# EAGLE design demo2 (EAGLE 6.0)
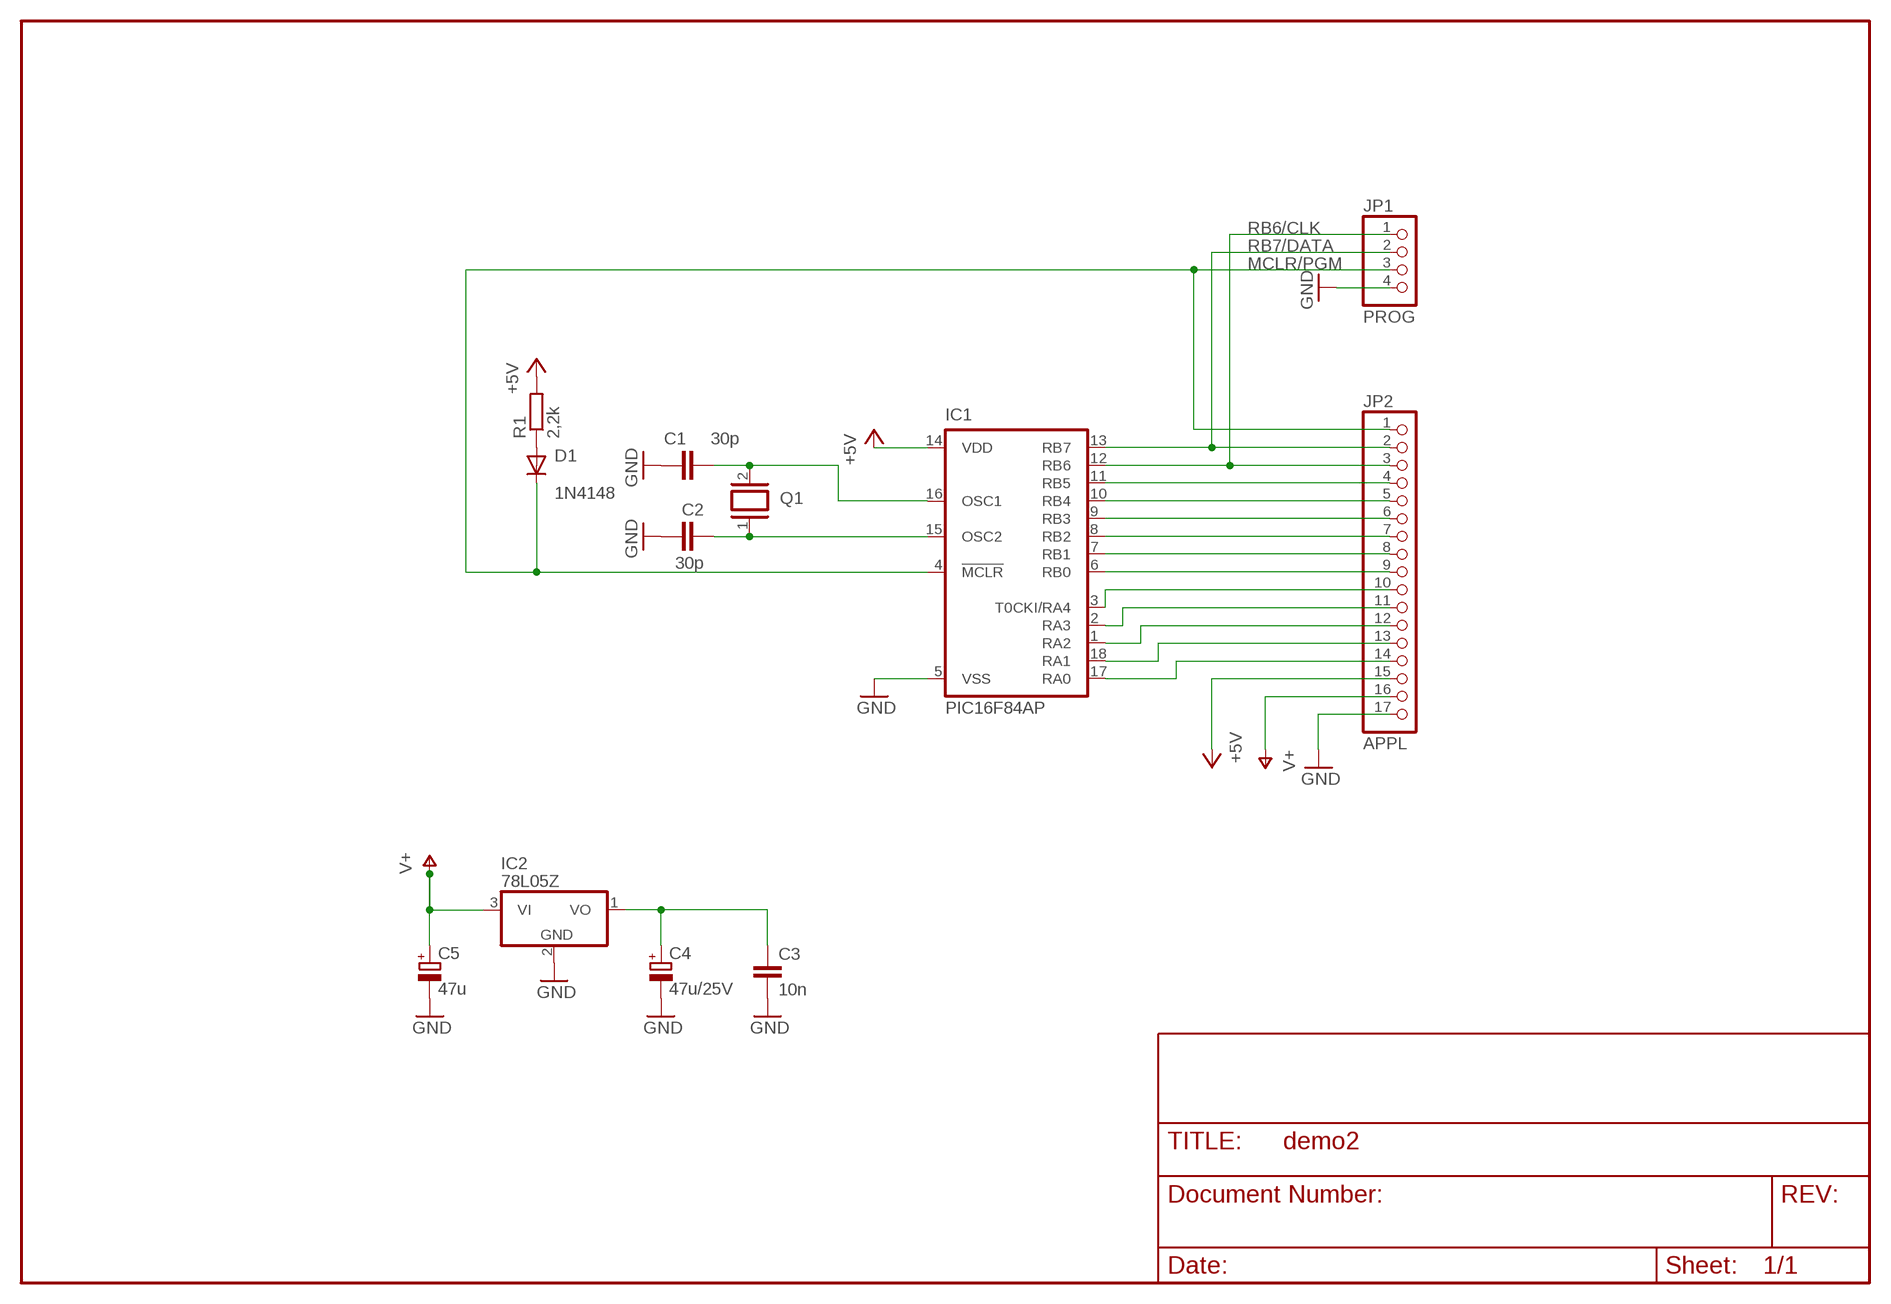
[diagram p0: schematic, sheet 1]

## Parts
C1  30p  C-EUC1206  [C1206]
C2  30p  C-EUC1206  [C1206]
C3  10n  C-EU025-025X050  [C025-025X050]
C4  47u/25V  CPOL-EUTAP5-45  [TAP5-45]
C5  47u  CPOL-EUTAP5-45  [TAP5-45]
D1  1N4148  [DO35-10]
IC1  PIC16F84AP  [DIL18]
IC2  78L05Z  [TO92]
JP1  PROG  PINHD-1X4  [1X04]
JP2  APPL  PINHD-1X17  [1X17]
Q1  XTAL/S  [QS]
R1  2,2k  R-EU_R1206  [R1206]

## Nets
+5V [power]: IC1.14(VDD) JP2.15 R1.1
GND [power]: C1.1 C2.1 C3.2 C4.- C5.- IC1.5(VSS) IC2.2(GND) JP1.4 JP2.17
MCLR/PGM: D1.C IC1.4(!MCLR) JP1.3 JP2.1
N$1: C3.1 C4.+ IC2.1(VO)
N$2: C1.2 IC1.16(OSC1) Q1.2
N$3: C2.2 IC1.15(OSC2) Q1.1
N$4: D1.A R1.2
RA0: IC1.17(RA0) JP2.14
RA1: IC1.18(RA1) JP2.13
RA2: IC1.1(RA2) JP2.12
RA3: IC1.2(RA3) JP2.11
RA4: IC1.3(T0CKI/RA4) JP2.10
RB0: IC1.6(RB0) JP2.9
RB1: IC1.7(RB1) JP2.8
RB2: IC1.8(RB2) JP2.7
RB3: IC1.9(RB3) JP2.6
RB4: IC1.10(RB4) JP2.5
RB5: IC1.11(RB5) JP2.4
RB6/CLK: IC1.12(RB6) JP1.1 JP2.3
RB7/DATA: IC1.13(RB7) JP1.2 JP2.2
V+ [power]: C5.+ IC2.3(VI) JP2.16

## Library data of the parts
C1-C3 = rcl:C-EU: CAPACITOR, European symbol
C4 C5 = rcl:CPOL-EU: POLARIZED CAPACITOR, European symbol
D1 = diode:1N4148: DIODE high speed (Philips)
IC1 = microchip:PIC16F8*: MICROCONTROLLER 8-Bit PIC16F8X Family - CMOS Flash/EEPROM Pin Compatible : PIC16F83, PIC16CR83, PIC16F84A, PIC16CR84 see also PIC16C*
IC2 = linear:78*: Positive VOLTAGE REGULATOR
JP1 = pinhead:PINHD-1X4: PIN HEADER
JP2 = pinhead:PINHD-1X17: PIN HEADER
Q1 = special:XTAL/S: CRYSTAL
R1 = rcl:R-EU_: RESISTOR, European symbol

## Net classes
0 default: width 0.3 mm, drill 0.6 mm, clearance 0.2 mm
1 power: width 0.4 mm, drill 0.6 mm, clearance 0.2 mm

## Board
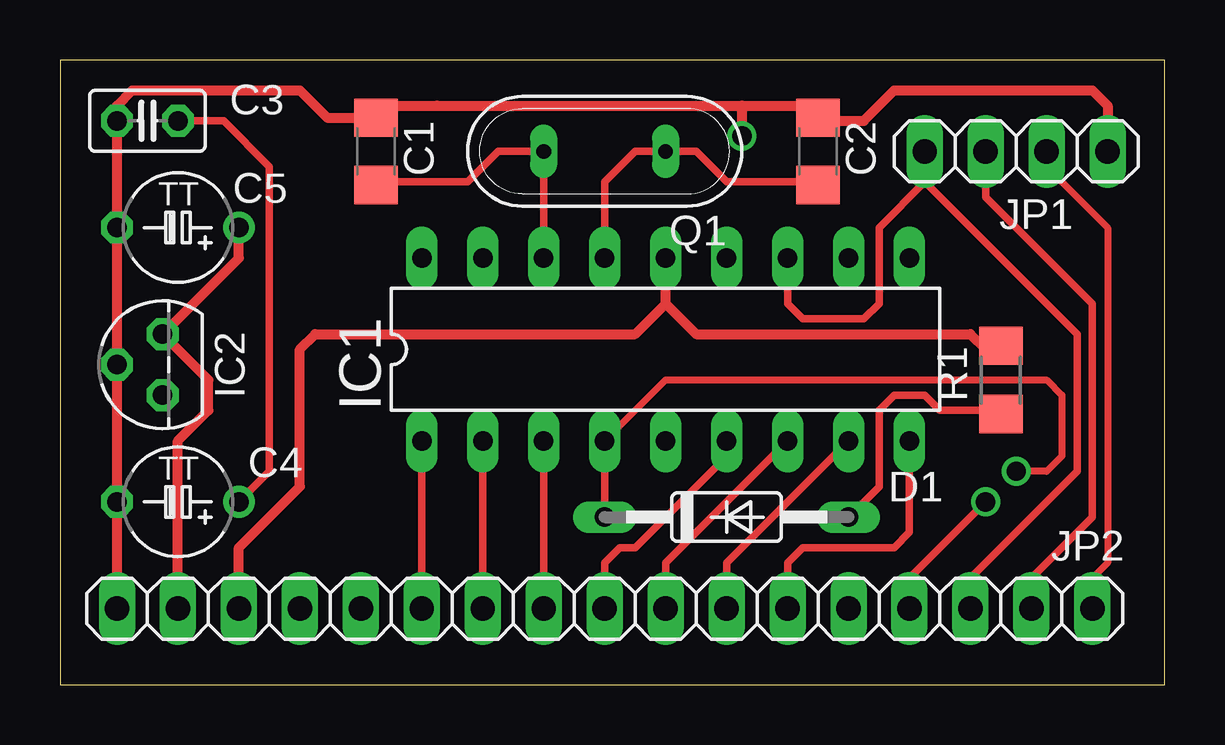
[diagram p1: board, top side]
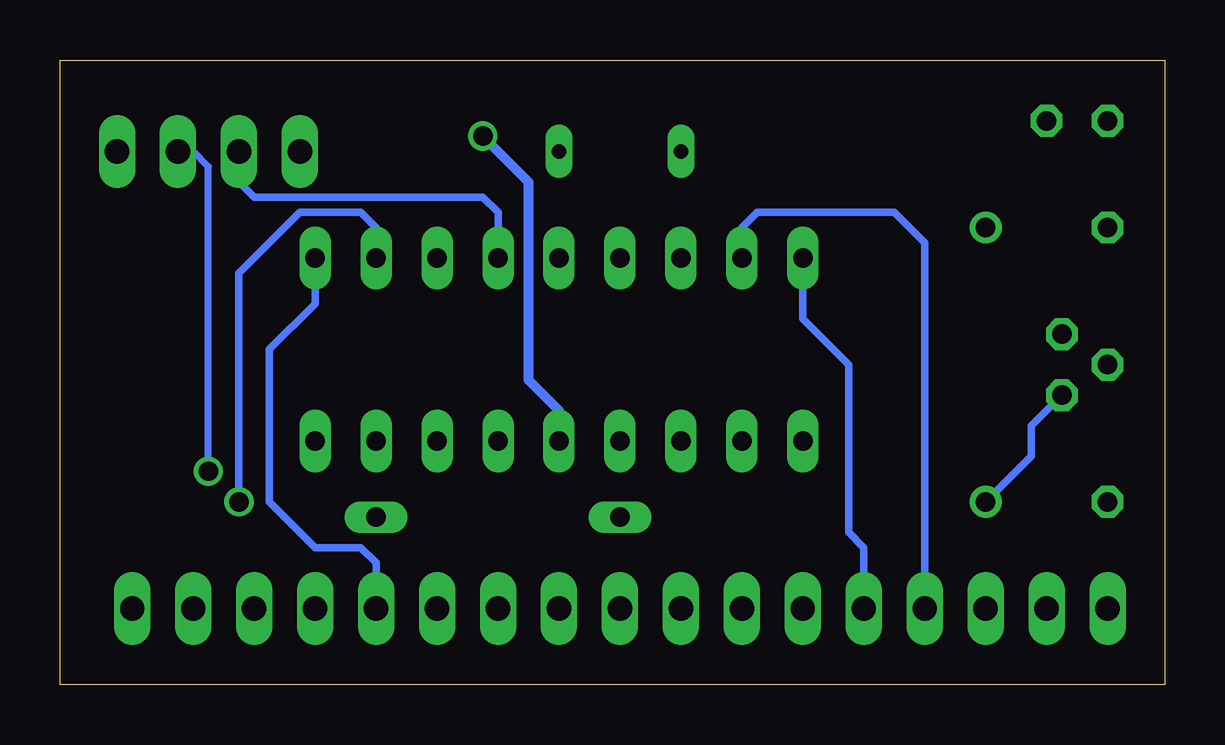
[diagram p2: board, bottom side, seen from below]

Size 46.02 x 26.02 mm. Coordinates in mm from the lower left corner, seen from the top.
Outline: 0,0 46.02,0 46.02,26.02 0,26.02 0,0
Copper layers (1*16): Top 0.035mm / dielectric 1.5mm / Bottom 0.035mm
Design rules: minimum track width 10mil, minimum drill 24mil, track to track 8mil, track to pad 8mil, pad to pad 8mil, via to via 8mil, smd to smd 8mil, copper to edge 40mil, drill to drill 8mil, minimum pad ring 10mil, minimum via ring 8mil, stop-mask expansion 4mil, vias tented up to drill 0mil, thermal gap 10mil

### Footprints (pad centres in the part's own frame; a part is rotated, then mirrored left to right if it is on the bottom)
C1206 = smd 1.6 x 1.8: 1 -1.4,0; 2 1.4,0
C025-025X050 = drill 0.813 octagon: 1 -1.27,0; 2 1.27,0
TAP5-45 = drill 0.813: + -2.54,0 | drill 0.813 octagon: - 2.54,0
DO35-10 = drill 0.813 long: A 5.08,0; C -5.08,0
DIL18 = drill 0.813 long: 1 -10.16,-3.81; 2 -7.62,-3.81; 3 -5.08,-3.81; 4 -2.54,-3.81; 5 0,-3.81; 6 2.54,-3.81; 7 5.08,-3.81; 8 7.62,-3.81; 9 10.16,-3.81; 10 10.16,3.81; 11 7.62,3.81; 12 5.08,3.81; 13 2.54,3.81; 14 0,3.81; 15 -2.54,3.81; 16 -5.08,3.81; 17 -7.62,3.81; 18 -10.16,3.81
TO92 = drill 0.813 octagon: 1 -1.27,0; 2 0,1.905; 3 1.27,0
1X04 = drill 1.016 long: 1 -3.81,0; 2 -1.27,0; 3 1.27,0; 4 3.81,0
1X17 = drill 1.016 long: 1 -20.32,0; 2 -17.78,0; 3 -15.24,0; 4 -12.7,0; 5 -10.16,0; 6 -7.62,0; 7 -5.08,0; 8 -2.54,0; 9 0,0; 10 2.54,0; 11 5.08,0; 12 7.62,0; 13 10.16,0; 14 12.7,0; 15 15.24,0; 16 17.78,0; 17 20.32,0
QS = drill 0.61 long: 1 -2.54,0; 2 2.54,0
R1206 = smd 1.6 x 1.803: 1 -1.422,0; 2 1.422,0

### Placement (x,y rotation side)
C1  13.17,22.22 270 top
C2  31.58,22.22 270 top
C3  3.64,23.49 180 top
C4  4.92,7.62 180 top
C5  4.92,19.04 180 top
D1  27.77,6.98 0 top
IC1  25.23,13.97 0 top
IC2  4.28,13.33 90 top
JP1  39.84,22.22 0 top
JP2  22.7,3.17 180 top
Q1  22.7,22.22 180 top
R1  39.2,12.7 270 top

### Tracks (layer width: path | path; a pad name or v marks a point on that pad's centre or on a via)
+5V
  Top 0.406: 25.23,15.87 23.96,14.6 10.63,14.6 10,13.97 10,8.25 7.46,5.71 JP2.15 | 25.23,15.87 IC1.14 | 25.23,15.87 26.5,14.6 37.94,14.6 38.57,13.97 39.2,13.97 R1.1
GND  (via drill 0.81)
  Top 0.406: JP2.17 C4.- IC2.2 C5.- C3.2 2.38,24.12 3.01,24.76 10,24.76 11.13,23.62 13.04,23.62 13.17,23.49 | 28.41,24.12 15.71,24.12 13.81,24.12 13.17,23.49 | 28.41,24.12 30.95,24.12 | JP1.4 43.65,24.12 43.02,24.76 34.76,24.76 33.49,23.49 31.58,23.49 | 31.58,23.49 C2.1 31.58,23.49 | 28.41,24.12 30.95,24.12 | 28.41,24.12 v28.41,22.86 | 30.95,24.12 31.58,23.49 | 13.17,23.49 C1.1 13.17,23.49
  Bottom 0.406: v28.41,22.86 26.5,20.95 26.5,12.7 25.23,11.43 IC1.5
MCLR/PGM  (via drill 0.8)
  Top 0.3: JP2.1 43.02,4.44 43.65,5.08 43.65,19.04 41.11,21.58 JP1.3 | v39.84,8.89 41.11,8.89 41.74,9.52 41.74,12.06 41.11,12.7 25.23,12.7 IC1.4
  Top 0.305: D1.C IC1.4
  Bottom 0.3: v39.84,8.89 39.84,21.58 40.48,22.22 JP1.3
N$1
  Top 0.305: C3.1 6.82,23.49 8.73,21.58 8.73,8.89 C4.+
  Bottom 0.305: C4.+ 5.55,9.52 5.55,10.79 IC2.1
N$2
  Top 0.305: C1.2 13.3,20.95 16.98,20.95 18.25,22.22 Q1.2 IC1.16
N$3
  Top 0.305: IC1.15 22.7,20.95 23.96,22.22 Q1.1 26.5,22.22 27.77,20.95 31.58,20.95 C2.2
N$4
  Top 0.305: D1.A 34.12,8.25 34.12,11.43 34.76,12.06 36.03,12.06 36.66,11.43 39.2,11.43 R1.2
RA0
  Bottom 0.305: IC1.17 17.61,19.04 16.98,19.68 11.27,19.68 10,18.41 JP2.14
RA1
  Bottom 0.305: IC1.18 15.08,15.24 13.17,13.33 13.17,6.34 12.54,5.71 JP2.13
RA2
  Top 0.305: JP2.12 IC1.1
RA3
  Top 0.305: JP2.11 IC1.2
RA4
  Top 0.305: JP2.10 IC1.3
RB0
  Top 0.305: JP2.9 22.7,5.08 23.33,5.71 23.96,5.71 27.77,9.52 IC1.6
RB1
  Top 0.305: JP2.8 25.23,5.08 IC1.7
RB2
  Top 0.305: JP2.7 27.77,5.08 IC1.8
RB3
  Top 0.305: JP2.6 30.31,5.08 30.95,5.71 34.76,5.71 35.39,6.34 IC1.9
RB4
  Bottom 0.305: IC1.10 35.39,15.87 37.3,13.97 37.3,7.62 35.39,5.71 33.49,5.71 32.85,5.08 JP2.5
RB5  (via drill 0.81)
  Top 0.305: JP2.4 35.39,4.44 v38.57,7.62
  Bottom 0.305: v38.57,7.62 38.57,17.14 36.03,19.68 33.49,19.68 32.85,19.04 IC1.11
RB6/CLK
  Top 0.305: 36.03,20.95 42.38,14.6 42.38,8.89 37.94,4.44 JP2.3 | 36.03,20.95 JP1.1 | 36.03,20.95 34.12,19.04 34.12,15.87 33.49,15.24 30.95,15.24 30.31,15.87 IC1.12
RB7/DATA
  Top 0.305: JP1.2 38.57,20.31 43.02,15.87 43.02,6.98 40.48,4.44 JP2.2
  Bottom 0.305: IC1.13 27.77,19.68 28.41,20.31 37.94,20.31 38.57,20.95 JP1.2
V+
  Top 0.406: C5.+ 7.46,17.77 IC2.3 6.18,12.7 6.18,11.43 4.92,10.16 JP2.16